# Altium schematic sheet DSP.SchDoc
size A
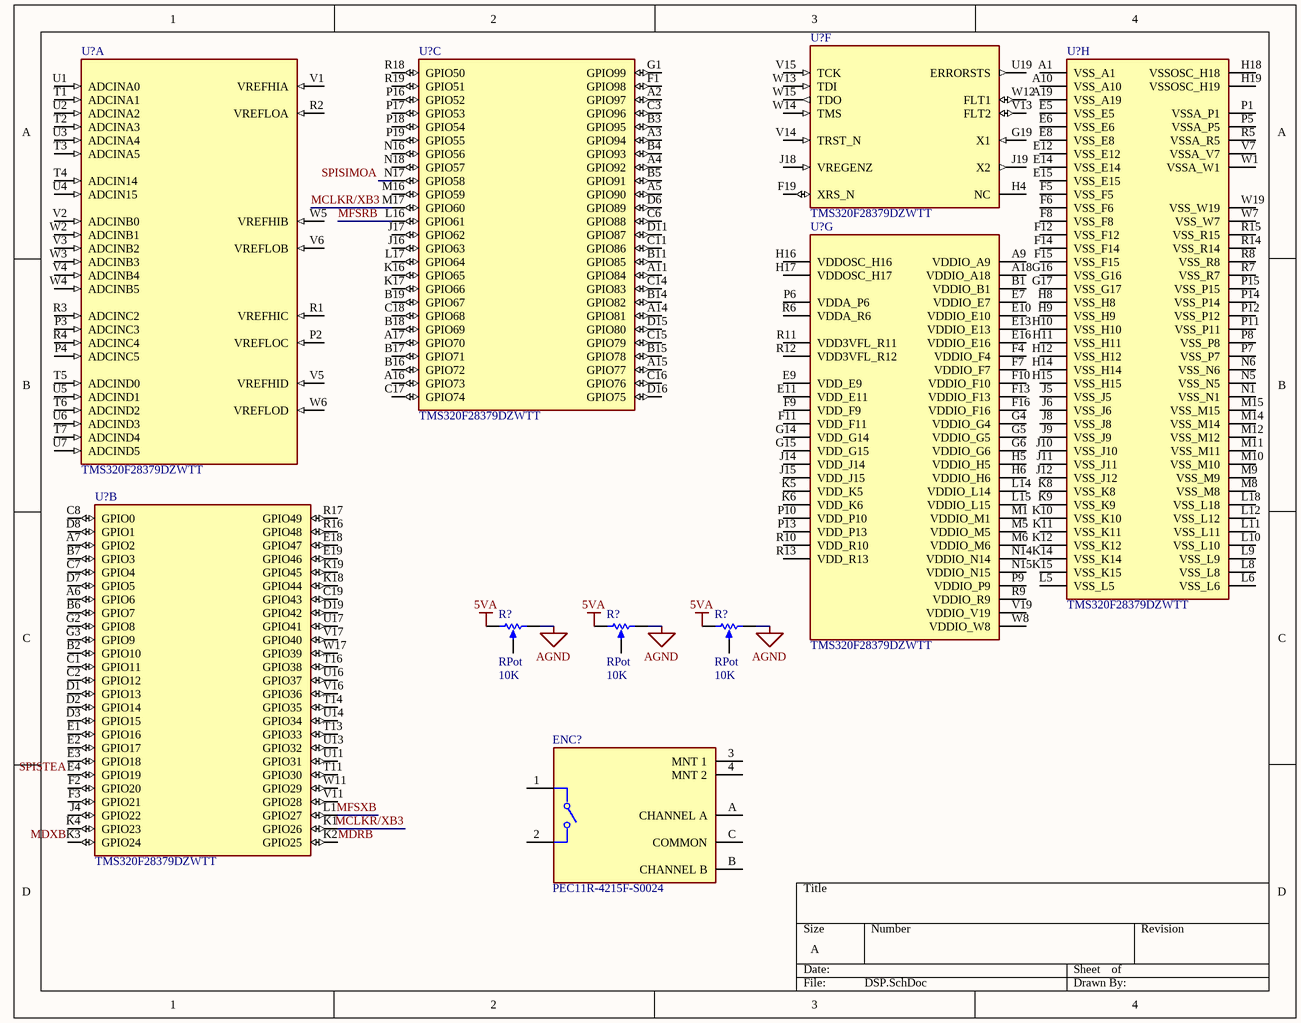
[diagram p0: DSP.SchDoc]

## Parts
(Parts that share a designator on the sheet are numbered #1, #2 ... from top to bottom, then left to right.)
ENC?  PEC11R-4215F-S0024  [FP-PEC11R-4215F-S0024-MFG]
R?#1  RPot  value 10K  [VR5]
R?#2  RPot  value 10K  [VR5]
R?#3  RPot  value 10K  [VR5]
U?#1  TMS320F28379DZWTT  [BGA337C80P19X19_1600X1600X140N]  (part F of 8)
U?#2  TMS320F28379DZWTT  [BGA337C80P19X19_1600X1600X140N]  (part C of 8)
U?#3  TMS320F28379DZWTT  [BGA337C80P19X19_1600X1600X140N]  (part A of 8)
U?#4  TMS320F28379DZWTT  [BGA337C80P19X19_1600X1600X140N]  (part H of 8)
U?#5  TMS320F28379DZWTT  [BGA337C80P19X19_1600X1600X140N]  (part G of 8)
U?#6  TMS320F28379DZWTT  [BGA337C80P19X19_1600X1600X140N]  (part B of 8)

## Nets
5VA: R?#1.1(TOP) R?#2.1(TOP) R?#3.1(TOP)
AGND: R?#1.2(BOT) R?#2.2(BOT) R?#3.2(BOT)
MCLKR/XB3: U?#2.M17(GPIO60) U?#6.K1(GPIO26)
MDRB: U?#6.K2(GPIO25)
MDXB: U?#6.K3(GPIO24)
MFSRB: U?#2.L16(GPIO61)
MFSXB: U?#6.L1(GPIO27)
SPISIMOA: U?#2.N17(GPIO58)
SPISTEA: U?#6.E4(GPIO19)

Not connected (* = marked no-connect by the designer): ENC? 1 2 3(MNT_1) 4(MNT_2) A(CHANNEL_A) B(CHANNEL_B) C(COMMON); R?#1 3(TAP); R?#2 3(TAP); R?#3 3(TAP); U?#1 F19(XRS_N) G19(X1) H4(NC) J18(VREGENZ) J19(X2) U19(ERRORSTS) V13(FLT2) V14(TRST_N) V15(TCK) W12(FLT1) W13(TDI) W14(TMS) W15(TDO); U?#2 A2(GPIO97) A3(GPIO94) A4(GPIO92) A5(GPIO90) A11(GPIO84) A14(GPIO81) A15(GPIO77) A16(GPIO73) A17(GPIO70) B3(GPIO95) B4(GPIO93) B5(GPIO91) B11(GPIO85) B14(GPIO82) B15(GPIO78) B16(GPIO72) B17(GPIO71) B18(GPIO69) B19(GPIO67) C3(GPIO96) C6(GPIO88) C11(GPIO86) C14(GPIO83) C15(GPIO79) C16(GPIO76) C17(GPIO74) C18(GPIO68) D6(GPIO89) D11(GPIO87) D15(GPIO80) D16(GPIO75) F1(GPIO98) G1(GPIO99) J16(GPIO63) J17(GPIO62) K16(GPIO65) K17(GPIO66) L17(GPIO64) M16(GPIO59) N16(GPIO56) N18(GPIO57) P16(GPIO52) P17(GPIO53) P18(GPIO54) P19(GPIO55) R18(GPIO50) R19(GPIO51); U?#3 P2(VREFLOC) P3(ADCINC3) P4(ADCINC5) R1(VREFHIC) R2(VREFLOA) R3(ADCINC2) R4(ADCINC4) T1(ADCINA1) T2(ADCINA3) T3(ADCINA5) T4(ADCIN14) T5(ADCIND0) T6(ADCIND2) T7(ADCIND4) U1(ADCINA0) U2(ADCINA2) U3(ADCINA4) U4(ADCIN15) U5(ADCIND1) U6(ADCIND3) U7(ADCIND5) V1(VREFHIA) V2(ADCINB0) V3(ADCINB2) V4(ADCINB4) V5(VREFHID) V6(VREFLOB) W2(ADCINB1) W3(ADCINB3) W4(ADCINB5) W5(VREFHIB) W6(VREFLOD); U?#4 A1(VSS_A1) A10(VSS_A10) A19(VSS_A19) E5(VSS_E5) E6(VSS_E6) E8(VSS_E8) E12(VSS_E12) E14(VSS_E14) E15(VSS_E15) F5(VSS_F5) F6(VSS_F6) F8(VSS_F8) F12(VSS_F12) F14(VSS_F14) F15(VSS_F15) G16(VSS_G16) G17(VSS_G17) H8(VSS_H8) H9(VSS_H9) H10(VSS_H10) H11(VSS_H11) H12(VSS_H12) H14(VSS_H14) H15(VSS_H15) H18(VSSOSC_H18) H19(VSSOSC_H19) J5(VSS_J5) J6(VSS_J6) J8(VSS_J8) J9(VSS_J9) J10(VSS_J10) J11(VSS_J11) J12(VSS_J12) K8(VSS_K8) K9(VSS_K9) K10(VSS_K10) K11(VSS_K11) K12(VSS_K12) K14(VSS_K14) K15(VSS_K15) L5(VSS_L5) L6(VSS_L6) L8(VSS_L8) L9(VSS_L9) L10(VSS_L10) L11(VSS_L11) L12(VSS_L12) L18(VSS_L18) M8(VSS_M8) M9(VSS_M9) M10(VSS_M10) M11(VSS_M11) M12(VSS_M12) M14(VSS_M14) M15(VSS_M15) N1(VSS_N1) N5(VSS_N5) N6(VSS_N6) P1(VSSA_P1) P5(VSSA_P5) P7(VSS_P7) P8(VSS_P8) P11(VSS_P11) P12(VSS_P12) P14(VSS_P14) P15(VSS_P15) R5(VSSA_R5) R7(VSS_R7) R8(VSS_R8) R14(VSS_R14) R15(VSS_R15) V7(VSSA_V7) W1(VSSA_W1) W7(VSS_W7) W19(VSS_W19); U?#5 A9(VDDIO_A9) A18(VDDIO_A18) B1(VDDIO_B1) E7(VDDIO_E7) E9(VDD_E9) E10(VDDIO_E10) E11(VDD_E11) E13(VDDIO_E13) E16(VDDIO_E16) F4(VDDIO_F4) F7(VDDIO_F7) F9(VDD_F9) F10(VDDIO_F10) F11(VDD_F11) F13(VDDIO_F13) F16(VDDIO_F16) G4(VDDIO_G4) G5(VDDIO_G5) G6(VDDIO_G6) G14(VDD_G14) G15(VDD_G15) H5(VDDIO_H5) H6(VDDIO_H6) H16(VDDOSC_H16) H17(VDDOSC_H17) J14(VDD_J14) J15(VDD_J15) K5(VDD_K5) K6(VDD_K6) L14(VDDIO_L14) L15(VDDIO_L15) M1(VDDIO_M1) M5(VDDIO_M5) M6(VDDIO_M6) N14(VDDIO_N14) N15(VDDIO_N15) P6(VDDA_P6) P9(VDDIO_P9) P10(VDD_P10) P13(VDD_P13) R6(VDDA_R6) R9(VDDIO_R9) R10(VDD_R10) R11(VDD3VFL_R11) R12(VDD3VFL_R12) R13(VDD_R13) V19(VDDIO_V19) W8(VDDIO_W8); U?#6 A6(GPIO6) A7(GPIO2) B2(GPIO10) B6(GPIO7) B7(GPIO3) C1(GPIO11) C2(GPIO12) C7(GPIO4) C8(GPIO0) C19(GPIO43) D1(GPIO13) D2(GPIO14) D3(GPIO15) D7(GPIO5) D8(GPIO1) D19(GPIO42) E1(GPIO16) E2(GPIO17) E3(GPIO18) E18(GPIO47) E19(GPIO46) F2(GPIO20) F3(GPIO21) G2(GPIO8) G3(GPIO9) J4(GPIO22) K4(GPIO23) K18(GPIO44) K19(GPIO45) R16(GPIO48) R17(GPIO49) T11(GPIO30) T13(GPIO33) T14(GPIO35) T16(GPIO38) U11(GPIO31) U13(GPIO32) U14(GPIO34) U16(GPIO37) U17(GPIO41) V11(GPIO28) V16(GPIO36) V17(GPIO40) W11(GPIO29) W17(GPIO39)

## Library data of the parts
ENC? = CMP-1747-00012-2: ROTARY ENCODER MECHANICAL 24PPR; Hole Diameter: 1.8mm; Output Type: Quadrature; Pulses per Revolution: 24; Number of Channels: 2; Built in Switch: Yes; Min Operating Temperature: -30°C; Series: PEC11R; Type: Mechanical; Package Quantity: 150; Length: 21.5mm; Max Operating Temperature: 70°C; Encoder Type: Mechanical; Height: 13.4mm; Detent: Yes; Packaging: Bulk; Orientation: Vertical; Width: 12.5mm; Termination: PC Pins; Mount: Through Hole; REACH SVHC: No SVHC; Radiation Hardening: No; RoHS Compliant: Yes
R?#1-R?#3 = RPot: Potentiometer; Sim Note: Enter the Resistance value and the set point into parameter fields.; Set Position: 0.5; Published: 8-Jun-2000; LatestRevisionDate: 17-Jul-2002; LatestRevisionNote: Re-released for DXP Platform.; PackageReference: VR5; Publisher: Altium Limited; PackageDescription: Variable Resistor, Thru-Hole; 3 Leads
U?#1-U?#6 = TMS320F28379DZWTT: C2000 32-bit MCU with 800 MIPS, 2xCPU, 2xCLA, FPU, TMU, 1024 KB Flash, CLB, EMIF, 16b ADC 337-NFBGA -40 to 105; Value: *; Availability: Unavailable; Package: None; MP: TMS320F28379DZWTT; Price: None